# Altium schematic sheet USB.SchDoc
size A3; Author: HamidFijani; DrawnBy: HamidFijani; SheetNumber: 9; SheetTotal: 13
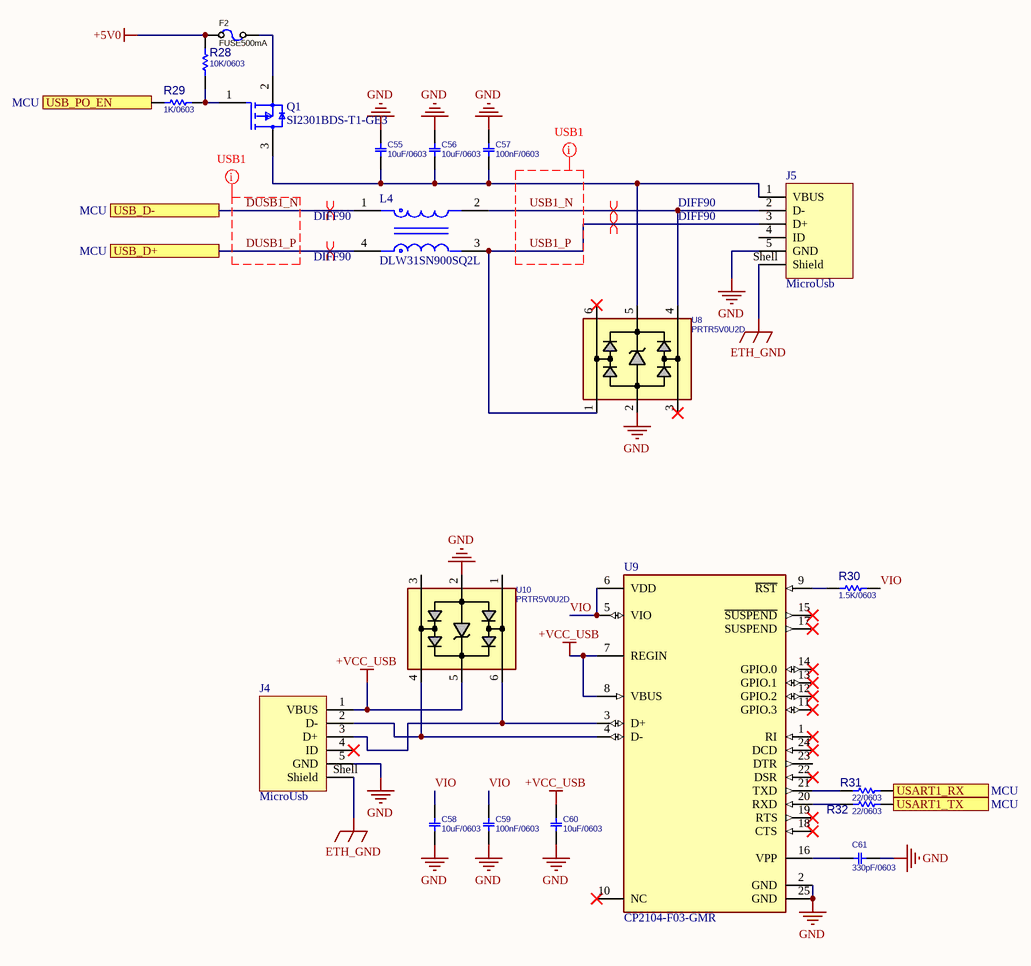
[diagram p0: USB.SchDoc]

## Parts
?  (no value)  (graphical)
C55  10uF/0603  [C0603]
C56  10uF/0603  [C0603]
C57  100nF/0603  [C0603]
C58  10uF/0603  [C0603]
C59  100nF/0603  [C0603]
C60  10uF/0603  [C0603]
C61  330pF/0603  [C0603]
F2  FUSE500mA  [F1206]
J4  MicroUsb  [MicroUsb]
J5  MicroUsb  [MicroUsb]
L4  DLW31SN900SQ2L  [FP-DLW31S-MFG]
Q1  SI2301BDS-T1-GE3  [FP-S-03946-MFG]
R28  10K/0603  [R0603]
R29  1K/0603  [R0603]
R30  1.5K/0603  [R0603]
R31  22/0603  [R0603]
R32  22/0603  [R0603]
U8  PRTR5V0U2D  [SOT23_6]
U9  CP2104-F03-GMR  [FP-CP2104-F03-GMR-IPC_C]
U10  PRTR5V0U2D  [SOT23_6]

## Ports
USART1_RX (see MCU), USART1_TX (see MCU), USB_D+ (see MCU), USB_D- (see MCU), USB_PO_EN (see MCU)

## Nets
+5V0: F2.1 R28.1
+VCC_USB: C60.2 J4.1(VBUS) U9.7(REGIN) U9.8(VBUS) U10.5
ETH_GND: J4.Shell(Shield) J5.Shell(Shield)
GND: C55.1 C56.1 C57.1 C58.1 C59.1 C60.1 C61.1 J4.5(GND) J5.5(GND) U8.2 U9.2(GND) U9.25(GND) U10.2
DUSB1_N: L4.1 ; port USB_D-
DUSB1_P: L4.4 ; port USB_D+
USART1_RX: R31.2 ; port USART1_RX
USART1_TX: R32.2 ; port USART1_TX
USB1_N: J5.2(D-) L4.2 U8.4
USB1_P: J5.3(D+) L4.3 U8.1
USB_PO_EN: R29.1 ; port USB_PO_EN
VIO: C58.2 C59.2 R30.2 U9.5(VIO) U9.6(VDD)
NetC55_2: C55.2 C56.2 C57.2 J5.1(VBUS) Q1.3(D) U8.5
NetC61_2: C61.2 U9.16(VPP)
NetF2_2: F2.2 Q1.2(S)
NetJ4_2: J4.2(D-) U9.4(D-) U10.4
NetJ4_3: J4.3(D+) U9.3(D+) U10.6
NetQ1_1: Q1.1(G) R28.2 R29.2
NetR30_1: R30.1 U9.9(~{RST})
NetR31_1: R31.1 U9.21(TXD)
NetR32_1: R32.1 U9.20(RXD)

Not connected (* = marked no-connect by the designer): J4 4(ID)*; J5 4(ID); U8 3* 6*; U9 1(RI)* 10(NC)* 11(GPIO.3)* 12(GPIO.2)* 13(GPIO.1)* 14(GPIO.0)* 15(~{SUSPEND})* 17(SUSPEND)* 18(CTS)* 19(RTS)* 22(DSR)* 23(DTR) 24(DCD)*; U10 1 3

## Layout directives
differential pair; differential pair class DIFF90: DUSB1_N, DUSB1_P, USB1_N, USB1_P
net class USB1: DUSB1_N, DUSB1_P, USB1_N, USB1_P

## Notes on the sheet
- Title:
- Page Contents:
- Variant:
- Checked by
- Size:
- Date:
- DWG NO
- Sheet
- of
- Revision:

## Library data of the parts
? = SDTitleBlock
C55-C61 = CAP_SMD_MLCC_0402: CAP, MLCC, -F, -V, MATERIAL, -%, 0201; PARAM: -, -%; MANF_P#: MANF_PART#; PRICE: 100= 1$; MANF: -; PARAM2: -V; ASSEMBLY: ASSEMBLY
  C55 C56 C58 C60: VALUE: 10uF/0603
  C57 C59: VALUE: 100nF/0603
  C61: VALUE: 330pF/0603
F2 = FUSE_160mA_1206: Fuse, 160mA, 63VDC, 1206, SMD, Fast Acting; PARAM: 160mA; 63VDC; slow-blow; MANF: Holly Fuse; MANF_P#: 12T-0160L; PARAM2: PARAM2; VALUE: FUSE500mA
L4 = CMP-06045-000166-1: CMC 370MA 2LN 90 OHM SMD; Frequency: 100MHz; DC Resistance (DCR): 300mR; Tolerance: 25%; Shielding: Unshielded; Impedance: 90R; Voltage Rating: 50V; Number of Lines: 2; Weight: 0.001376oz; Case/Package: 1206; Width: 0.063inch; Case Code (Imperial): 1206; Max Operating Temperature: 85°C; Lead Free: Lead Free; Max DC Current: 370mA; DC Current: 370mA; Military Standard: Not; Package Quantity: 1; Radiation Hardening: No; Packaging: Tape and Reel; Depth: 1.6mm; Height: 1.9mm; Termination: SMD/SMT; Current: 370mA; Length: 3.2mm; Current Rating: 370mA; Resistor Type: Wirewound; Mount: Surface Mount; Min Operating Temperature: -40°C; Test Frequency: 100MHz
Q1 = CMP-00030-42864886-1: SI2301BDS-T1-GE3 Trans Mosfet P-ch Si 20V 2.2A 3-PIN SOT-23 T/r / Mosfet P-ch 20V 2.2A SOT23-3; Rise Time: 40ns; Nominal Vgs: -950mV; Gate to Source Voltage (Vgs): 8V; Element Configuration: Single; Number of Channels: 1; Power Dissipation: 700mW; Resistance: 100MΩ; Continuous Drain Current (ID): -2.2A; Drain to Source Breakdown Voltage: -20V; Turn-On Delay Time: 20ns; Turn-Off Delay Time: 30ns; Input Capacitance: 375pF; Schedule B: 8541210080, 8541210080; Length: 3.04mm; Height: 1.02mm; Radiation Hardening: No; RoHS: Compliant; NexarPartId: 42864886; Number of Pins: 3; Weight: 1.437803g; Mount: Surface Mount; Min Operating Temperature: -55°C; Number of Elements: 1; Drain to Source Resistance: 100mΩ; Max Power Dissipation: 700mW; Threshold Voltage: -950mV; Lead Free: Lead Free; Rds On Max: 100mΩ; Width: 1.4mm; REACH SVHC: Unknown; Fall Time: 40ns; Max Operating Temperature: 150°C; Drain to Source Voltage (Vdss): -20V; Case/Package: SOT-23-3
R28-R32 = RES_SMD_0603: RESISTOR, SMD; PARAM: -W; DESC: DESCRIPTION; DIST#: MOUSER; PARAM2: 1%; MANF_P#: -; MANF: -; ASSEMBLY: ASSEMBLY; PRICE: 100= 0.5$
  R28: VALUE: 10K/0603
  R29: VALUE: 1K/0603
  R30: VALUE: 1.5K/0603
  R31 R32: VALUE: 22/0603
U8 U10 = TVS_X3_PRTR5V0U2D: TVS, ESD PROTECT, 3CH; MANF: NXP; MANF_P#: PRTR5V0U2D; VALUE: PRTR5V0U2D
U9 = CMP-08107-000004-1: IC SGL USB-TO-UART BRIDGE 24QFN; Manufacturer: Silicon Laboratories; Max Supply Voltage: 3.6V; Min Supply Voltage: 1.8V; Nominal Supply Current: 100-17000uA; Standoff Height: 0mm; Interface: UART,USB; Temperature Range Low: -40°C; Lead Free: Yes; Device Class L3: Controllers; Ambient Temperature Range Low: -55°C; Automotive: No; Category: IC; Temperature: -40°C to +85°C; Octopart: https://octopart.com/cp2104-f03-gmr-silicon+labs-19668642; Ambient Temperature Range High: +125°C; Package: CP2104-F03-GMR; Device Class L2: Interface ICs; Digikey Description: IC SGL USB-TO-UART BRIDGE 24QFN; Device Class L1: Integrated Circuits (ICs); Manufacturer Part Number: CP2104-F03-GMR; Temperature Range High: +85°C; ComponentLink2URL: https://www.silabs.com/documents/public/data-sheets/cp2104.pdf; Height: 0.8mm; Ipc Land Pattern Name: QFN50P400X400X75-24; Mouser Description: I/O Controller Interface IC USB to UART bridge; ComponentLink2Description: Datasheet; RoHS: TRUE